# Altium schematic sheet Sheet3.SchDoc
size 420 x 297 mm
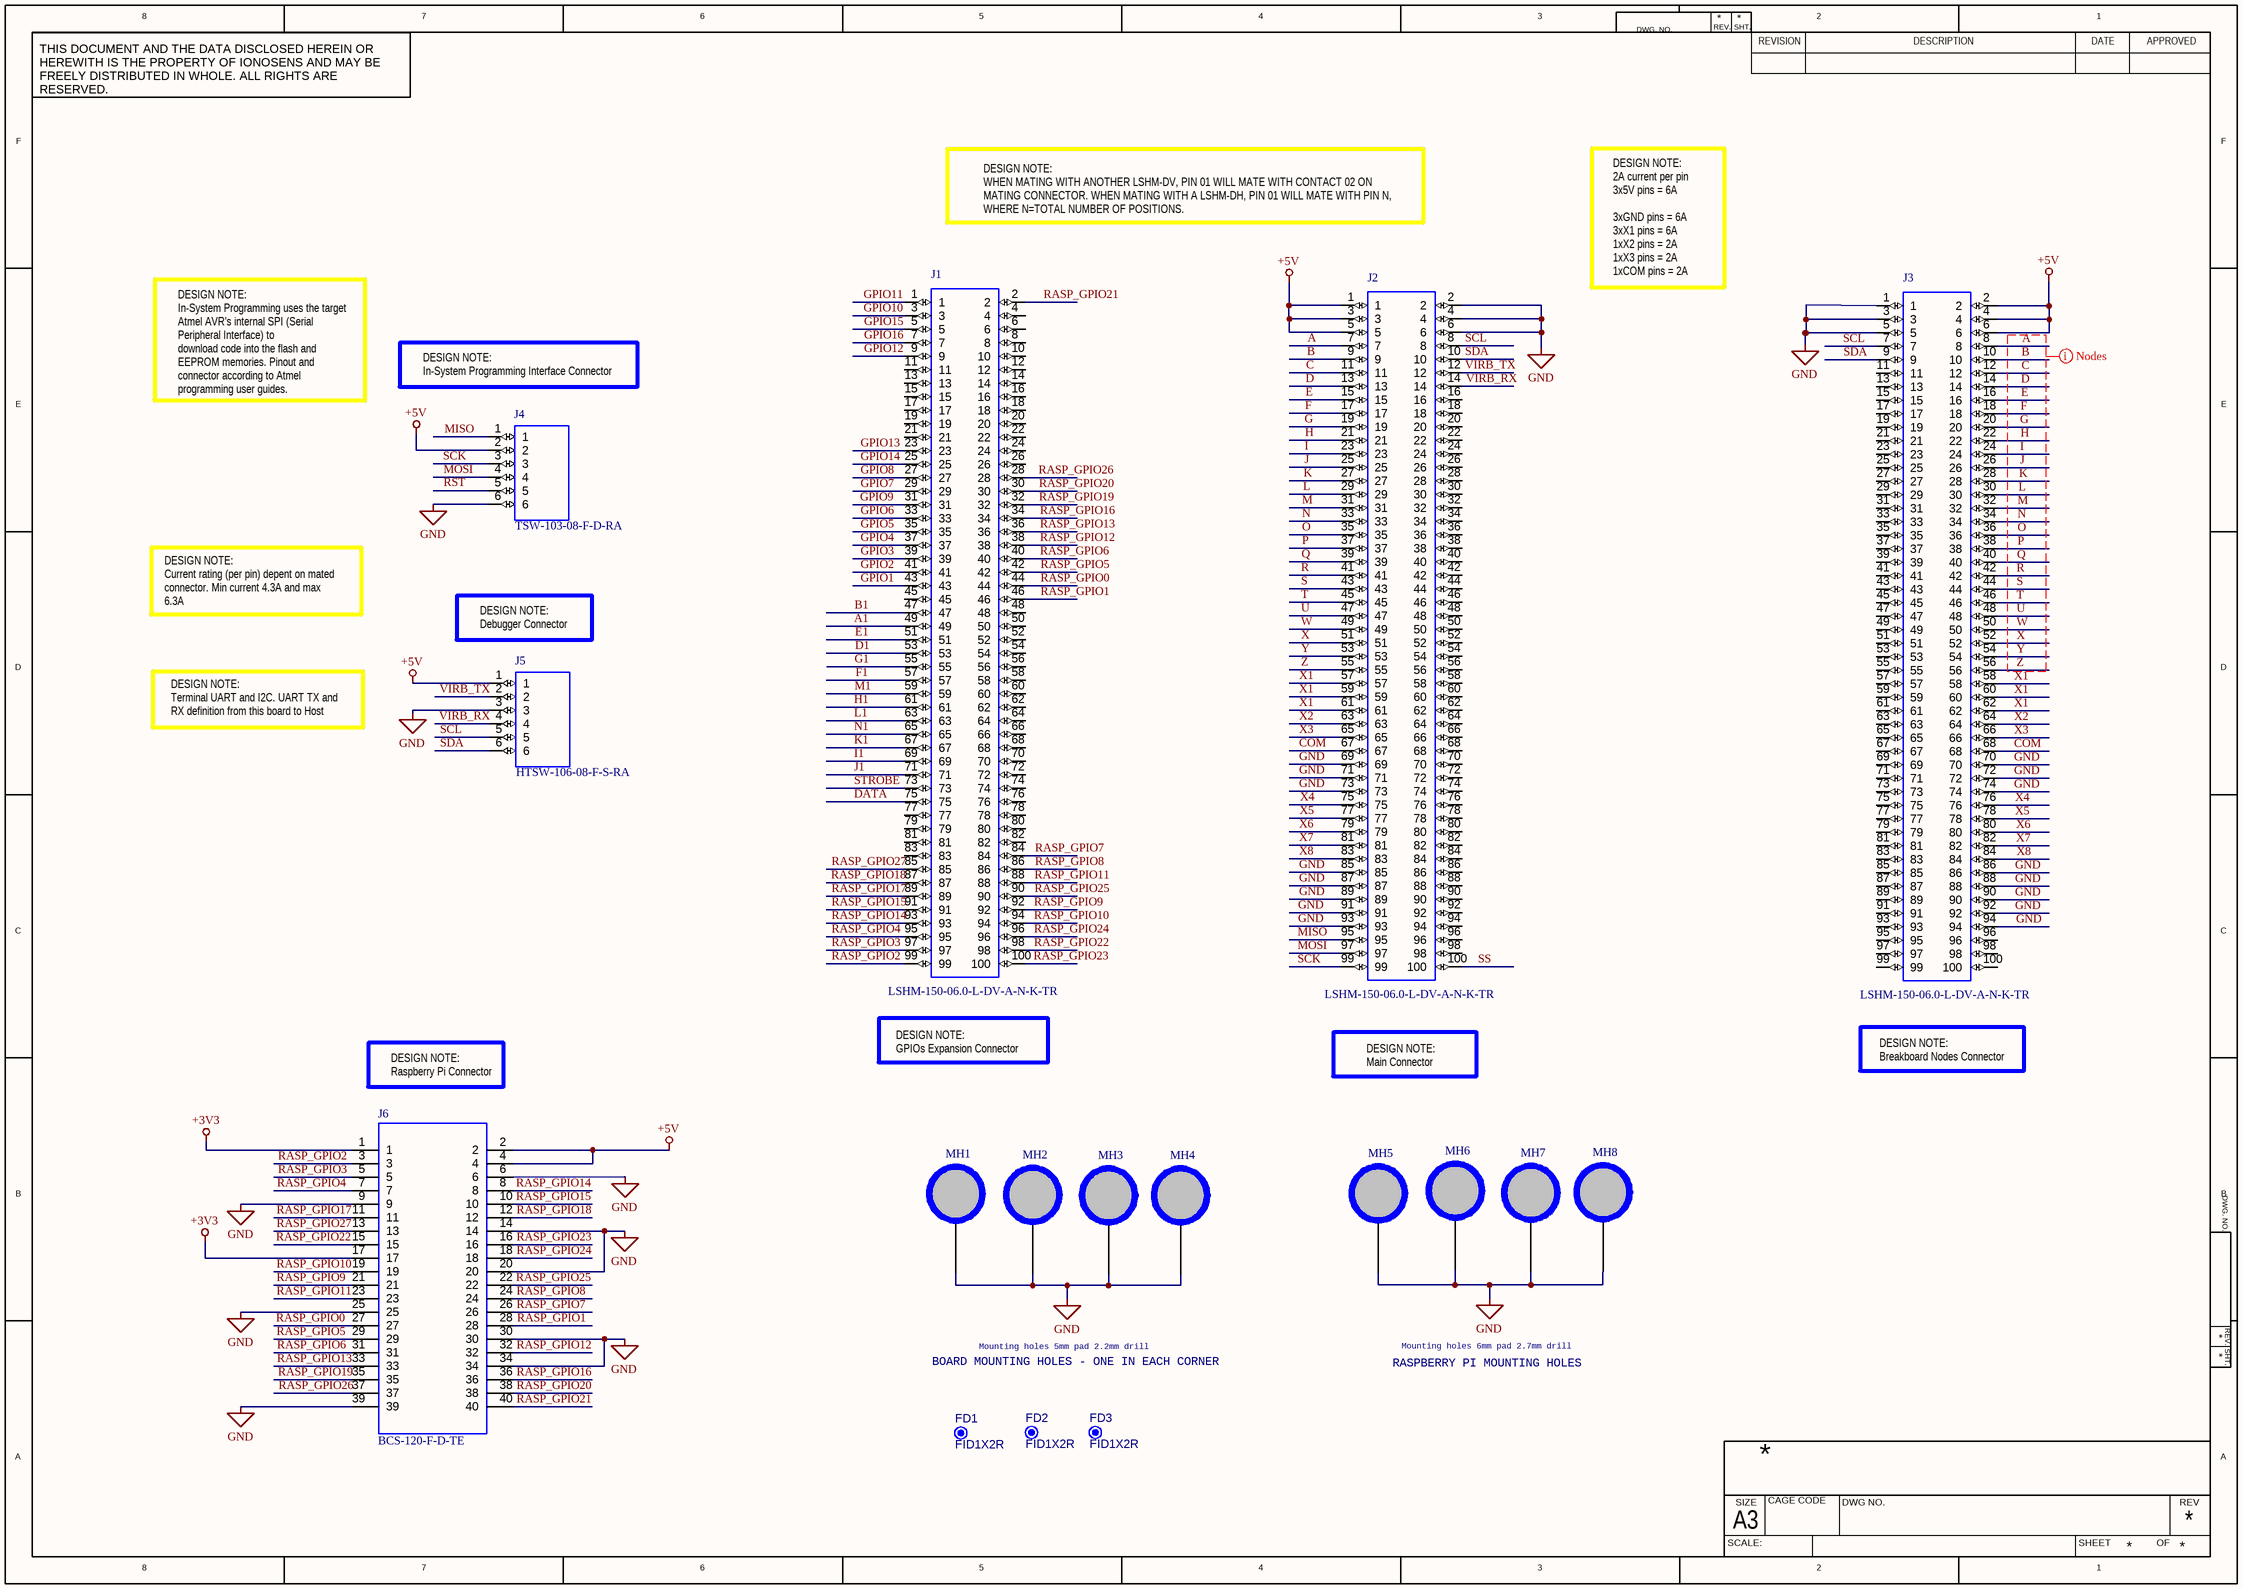
[diagram p0: Sheet3.SchDoc]

## Parts
FD1  FID1X2R  [FID1X2R]  (no BOM)
FD2  FID1X2R  [FID1X2R]  (no BOM)
FD3  FID1X2R  [FID1X2R]  (no BOM)
J1  LSHM-150-06.0-L-DV-A-N-K-TR  [LSHM_150_06_0_L_DV_A_N_K_TR]
J2  LSHM-150-06.0-L-DV-A-N-K-TR  [LSHM_150_06_0_L_DV_A_N_K_TR]
J3  LSHM-150-06.0-L-DV-A-N-K-TR  [LSHM_150_06_0_L_DV_A_N_K_TR]
J4  TSW-103-08-F-D-RA  [TSW-103-08-F-D-RA]
J5  HTSW-106-08-F-S-RA  [TSW-106-08-F-S-RA]
J6  BCS-120-F-D-TE  [BCS-120-F-D-TE]
MH1  C500h220  [C500h220z368]  (value not drawn)
MH2  C500h220  [C500h220z368]  (value not drawn)
MH3  C500h220  [C500h220z368]  (value not drawn)
MH4  C500h220  [C500h220z368]  (value not drawn)
MH5  C600h270  [C600h270z368]  (value not drawn)
MH6  C600h270  [C600h270z368]  (value not drawn)
MH7  C600h270  [C600h270z368]  (value not drawn)
MH8  C600h270  [C600h270z368]  (value not drawn)

## Nets
+3V3: J6.1 J6.17
+5V: J2.1 J2.3 J2.5 J3.2 J3.4 J3.6 J4.2 J5.1 J6.2 J6.4
GND: J2.2 J2.4 J2.6 J2.69 J2.71 J2.73 J2.85 J2.87 J2.89 J2.91 J2.93 J3.1 J3.3 J3.5 J3.70 J3.72 J3.74 J3.86 J3.88 J3.90 J3.92 J3.94 J4.6 J5.3 J6.6 J6.9 J6.14 J6.20 J6.25 J6.30 J6.34 J6.39 MH1.1 MH2.1 MH3.1 MH4.1 MH5.1 MH6.1 MH7.1 MH8.1
A: J2.7 J3.8
A1: J1.49
B: J2.9 J3.10
B1: J1.47
C: J2.11 J3.12
COM: J2.67 J3.68
D: J2.13 J3.14
D1: J1.53
DATA: J1.75
E: J2.15 J3.16
E1: J1.51
F: J2.17 J3.18
F1: J1.57
G: J2.19 J3.20
G1: J1.55
GPIO1: J1.43
GPIO2: J1.41
GPIO3: J1.39
GPIO4: J1.37
GPIO5: J1.35
GPIO6: J1.33
GPIO7: J1.29
GPIO8: J1.27
GPIO9: J1.31
GPIO10: J1.3
GPIO11: J1.1
GPIO12: J1.9
GPIO13: J1.23
GPIO14: J1.25
GPIO15: J1.5
GPIO16: J1.7
H: J2.21 J3.22
H1: J1.61
I: J2.23 J3.24
I1: J1.69
J: J2.25 J3.26
J1: J1.71
K: J2.27 J3.28
K1: J1.67
L: J2.29 J3.30
L1: J1.63
M: J2.31 J3.32
M1: J1.59
MISO: J2.95 J4.1
MOSI: J2.97 J4.4
N: J2.33 J3.34
N1: J1.65
O: J2.35 J3.36
P: J2.37 J3.38
Q: J2.39 J3.40
R: J2.41 J3.42
RASP_GPIO0: J1.44 J6.27
RASP_GPIO1: J1.46 J6.28
RASP_GPIO2: J1.99 J6.3
RASP_GPIO3: J1.97 J6.5
RASP_GPIO4: J1.95 J6.7
RASP_GPIO5: J1.42 J6.29
RASP_GPIO6: J1.40 J6.31
RASP_GPIO7: J1.84 J6.26
RASP_GPIO8: J1.86 J6.24
RASP_GPIO9: J1.92 J6.21
RASP_GPIO10: J1.94 J6.19
RASP_GPIO11: J1.88 J6.23
RASP_GPIO12: J1.38 J6.32
RASP_GPIO13: J1.36 J6.33
RASP_GPIO14: J1.93 J6.8
RASP_GPIO15: J1.91 J6.10
RASP_GPIO16: J1.34 J6.36
RASP_GPIO17: J1.89 J6.11
RASP_GPIO18: J1.87 J6.12
RASP_GPIO19: J1.32 J6.35
RASP_GPIO20: J1.30 J6.38
RASP_GPIO21: J1.2 J6.40
RASP_GPIO22: J1.98 J6.15
RASP_GPIO23: J1.100 J6.16
RASP_GPIO24: J1.96 J6.18
RASP_GPIO25: J1.90 J6.22
RASP_GPIO26: J1.28 J6.37
RASP_GPIO27: J1.85 J6.13
RST: J4.5
S: J2.43 J3.44
SCK: J2.99 J4.3
SCL: J2.8 J3.7 J5.5
SDA: J2.10 J3.9 J5.6
SS: J2.100
STROBE: J1.73
T: J2.45 J3.46
U: J2.47 J3.48
VIRB_RX: J2.14 J5.4
VIRB_TX: J2.12 J5.2
W: J2.49 J3.50
X: J2.51 J3.52
X1: J2.57 J2.59 J2.61 J3.58 J3.60 J3.62
X2: J2.63 J3.64
X3: J2.65 J3.66
X4: J2.75 J3.76
X5: J2.77 J3.78
X6: J2.79 J3.80
X7: J2.81 J3.82
X8: J2.83 J3.84
Y: J2.53 J3.54
Z: J2.55 J3.56

Not connected (* = marked no-connect by the designer): J1 4 6 8 10 11 12 13 14 15 16 17 18 19 20 21 22 24 26 45 48 50 52 54 56 58 60 62 64 66 68 70 72 74 76 77 78 79 80 81 82 83; J2 16 18 20 22 24 26 28 30 32 34 36 38 40 42 44 46 48 50 52 54 56 58 60 62 64 66 68 70 72 74 76 78 80 82 84 86 88 90 92 94 96 98; J3 11 13 15 17 19 21 23 25 27 29 31 33 35 37 39 41 43 45 47 49 51 53 55 57 59 61 63 65 67 69 71 73 75 77 79 81 83 85 87 89 91 93 95 96 97 98 99 100

## Layout directives
net class Nodes: A, B, C, D, E, F, G, H, I, J, K, L, M, N, O, P, Q, R, S, T, U, W, X, Y, Z

## Notes on the sheet
- DESIGN NOTE:
  WHEN MATING WITH ANOTHER LSHM-DV, PIN 01 WILL MATE WITH CONTACT 02 ON
  MATING CONNECTOR. WHEN MATING WITH A LSHM-DH, PIN 01 WILL MATE WITH PIN N,
  WHERE N=TOTAL NUMBER OF POSITIONS.
- DESIGN NOTE:
  2A current per pin
  3x5V pins = 6A
  3xGND pins = 6A
  3xX1 pins = 6A
  1xX2 pins = 2A
  1xX3 pins = 2A
  1xCOM pins = 2A
- DESIGN NOTE:
  In-System Programming uses the target Atmel AVR’s internal SPI (Serial Peripheral Interface) to
  download code into the flash and EEPROM memories. Pinout and connector according to Atmel programming user guides.
- DESIGN NOTE:
  In-System Programming Interface Connector
- DESIGN NOTE:
  Current rating (per pin) depent on mated connector. Min current 4.3A and max 6.3A
- (near J5) DESIGN NOTE:
  Debugger Connector
- DESIGN NOTE:
  Terminal UART and I2C. UART TX and RX definition from this board to Host
- DESIGN NOTE:
  GPIOs Expansion Connector
- DESIGN NOTE:
  Main Connector
- DESIGN NOTE:
  Breakboard Nodes Connector
- DESIGN NOTE:
  Raspberry Pi Connector
- BOARD MOUNTING HOLES - ONE IN EACH CORNER
- Mounting holes 5mm pad 2.2mm drill
- RASPBERRY PI MOUNTING HOLES
- Mounting holes 6mm pad 2.7mm drill
- 8
- 7
- 6
- 5
- 4
- 3
- DWG. NO.
- REV.
- SHT.
- REVISION
- 2
- DESCRIPTION
- DATE
- 1
- APPROVED
- THIS DOCUMENT AND THE DATA DISCLOSED HEREIN OR HEREWITH IS THE PROPERTY OF IONOSENS AND MAY BE FREELY DISTRIBUTED IN WHOLE. ALL RIGHTS ARE RESERVED.
- F
- E
- D
- C
- B
- A
- SCALE:
- A3
- SIZE
- CAGE CODE
- DWG NO.
- SHEET
- OF
- REV

## Library data of the parts
FD1-FD3 = CMP-00028-00005-2: Fiducial - Round 1x2mm; Pins: 0
J1-J3 = J01-001-01-00001-2: Conn Socket and Terminal Strip HDR/SKT 100 POS 0.5mm Solder ST SMD T/R; Manufacturer: Samtec; Gender: HERMAPHRODITIC; Pitch: 500 µm; Contact Plating: Gold; Case/Package: SMD; Max Operating Temperature: 125°C; Number of Rows: 2; RoHS Compliant: Yes; Housing Color: Black; Mounting Technology: SMD; Pins: 100; Termination: Solder; Orientation: Straight; Depth: 4.98 mm; Length: 29.7 mm; Contact Material: Bronze; Housing Material: Polymer; Min Operating Temperature: -55°C; Manufacturer P/N: LSHM-150-06.0-L-DV-A-N-K-TR
J4 = J01-001-01-00003-2: 6 Vias Pin Header 2.54mm, Right Angle; Manufacturer: Samtec; Gender: Male; Orientation: Straight; Mounting Technology: Through Hole; Contact Material: Bronze; Housing Material: Polyester; Pitch: 2.54mm; Housing Color: Black; Termination: Solder; Min Operating Temperature: -55°C; Pins: 6; Depth: 4.87 mm; RoHS Compliant: Yes; Manufacturer P/N: TSW-103-08-F-D-RA; Length: 7.62 mm; Contact Plating: Gold; Number of Rows: 2; Max Operating Temperature: 125°C; Case/Package: Through Hole
J5 = J01-001-01-00005-2: 6 Vias Pin Header 2.54mm, Right Angle, 1 Row; Manufacturer: Samtec; Gender: Male; Mounting Technology: Through Hole; RoHS Compliant: Yes; Contact Plating: Gold; Max Operating Temperature: 125°C; Pins: 6; Housing Material: Polyester; Case/Package: Through Hole; Pitch: 2.54mm; Contact Material: Bronze; Length: 7.62 mm; Termination: Solder; Number of Rows: 2; Manufacturer P/N: HTSW-106-08-F-S-RA; Depth: 4.87 mm; Orientation: Straight; Min Operating Temperature: -55°C; Housing Color: Black
J6 = J01-001-01-00010-2: Conn Socket Strip SKT 40 POS 2.54mm Solder ST Top Entry Thru-Hole TIGER CLAW™ Tube; Manufacturer: Samtec; Gender: Female; Pins: 40; Max Operating Temperature: 125°C; Manufacturer P/N: BCS-120-F-D-TE; Case/Package: Through Hole; Contact Material: -; Number of Rows: 2; Pitch: 2.54mm; Housing Material: -; Termination: Solder; RoHS Compliant: Yes; Contact Plating: Gold; Depth: -; Length: -; Housing Color: -; Orientation: -; Min Operating Temperature: -40°C; Mounting Technology: SMD
MH1-MH4 = CMP-00028-00007-2: hole 5mm pad drill 2.2; Manufacturer: Ionosens; Manufacturer P/N: H5D22; Mounting Technology: Pad; RoHS Compliant: yes; Case/Package: Pad; Min Operating Temperature: 125°C; Pins: 1; Max Operating Temperature: -40°C
MH5-MH8 = CMP-00028-00009-1: hole 6mm pad drill 2.7; RoHS Compliant: yes; Mounting Technology: Pad; Min Operating Temperature: 125°C; Case/Package: Pad; Max Operating Temperature: -40°C; Pins: 1